# Altium schematic sheet USB_UART.SchDoc: USB UART
size Letter; Engineer: Nathan Petersen; DocumentNumber: 9; Revision: v1.2; SheetNumber: 9; SheetTotal: 26
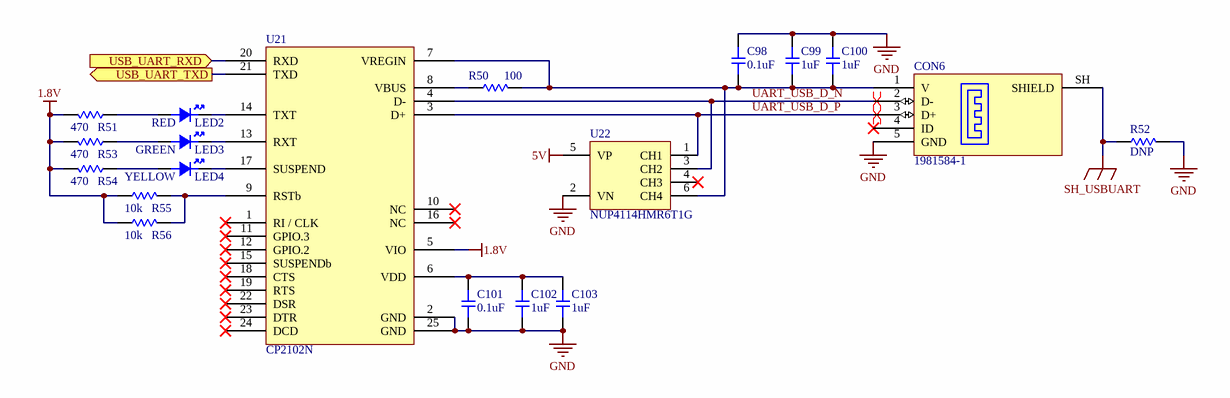
[diagram p0: USB_UART.SchDoc]

## Parts
C98  value 0.1uF  [0603-CAP]  (hidden comment: Capacitor)
C99  value 1uF  [0603-CAP]  (hidden comment: Capacitor)
C100  value 1uF  [0603-CAP]  (hidden comment: Capacitor)
C101  value 0.1uF  [0603-CAP]  (hidden comment: Capacitor)
C102  value 1uF  [0603-CAP]  (hidden comment: Capacitor)
C103  value 1uF  [0603-CAP]  (hidden comment: Capacitor)
CON6  1981584-1  [1981584-1]
LED2  value RED  [0603-LED]  (hidden comment: LED)
LED3  value GREEN  [0603-LED]  (hidden comment: LED)
LED4  value YELLOW  [0603-LED]  (hidden comment: LED)
R50  value 100  [0603-RES]  (hidden comment: Resistor)
R51  value 470  [0603-RES]  (hidden comment: Resistor)
R52  value DNP  [0603-RES]  (hidden comment: Resistor)
R53  value 470  [0603-RES]  (hidden comment: Resistor)
R54  value 470  [0603-RES]  (hidden comment: Resistor)
R55  value 10k  [0603-RES]  (hidden comment: Resistor)
R56  value 10k  [0603-RES]  (hidden comment: Resistor)
U21  CP2102N  [QFN50P400X400X80_HS-25N]
U22  NUP4114HMR6T1G  [TSOP95P280X110-6N]

## Ports
USB_UART_RXD (in), USB_UART_TXD (out)

## Nets
1.8V: R51.2 R53.2 R54.2 R55.1 R56.1 U21.5(VIO)
5V: U22.5(VP)
GND: C98.2 C99.2 C100.2 C101.1 C102.1 C103.1 CON6.5(GND) R52.2 U21.2(GND) U21.25(GND) U22.2(VN)
SH_USBUART: CON6.SH(SHIELD) R52.1
UART_USB_D_N: CON6.2(D-) U21.4(D-) U22.3(CH2)
UART_USB_D_P: CON6.3(D+) U21.3(D+) U22.1(CH1)
USB_UART_RXD: U21.20(RXD) ; port USB_UART_RXD
USB_UART_TXD: U21.21(TXD) ; port USB_UART_TXD
NetC98_1: C98.1 C99.1 C100.1 CON6.1(V) R50.2 U21.7(VREGIN) U22.6(CH4)
NetC101_2: C101.2 C102.2 C103.2 U21.6(VDD)
NetLED2_A: LED2.A R51.1
NetLED2_C: LED2.C U21.14(TXT)
NetLED3_A: LED3.A R53.1
NetLED3_C: LED3.C U21.13(RXT)
NetLED4_A: LED4.A R54.1
NetLED4_C: LED4.C U21.17(SUSPEND)
NetR50_1: R50.1 U21.8(VBUS)
NetR55_2: R55.2 R56.2 U21.9(RSTb)

Not connected (* = marked no-connect by the designer): CON6 4(ID)*; U21 1(RI_/_CLK)* 10(NC)* 11(GPIO.3)* 12(GPIO.2)* 15(SUSPENDb)* 16(NC)* 18(CTS)* 19(RTS)* 22(DSR)* 23(DTR)* 24(DCD)*; U22 4(CH3)*

## Layout directives
differential pair: UART_USB_D_N, UART_USB_D_P

## Notes on the sheet
- Title:
- File:
- Sheet:
- of
- Revision:
- Time:
- Date:
- Engineer:

## Library data of the parts
CON6 = 1981584-1: CONN RCPT MICRO USB TYPE AB; Supplier 1: Digi-Key; Supplier Part Number 1: A97799TR-ND
U21 = CP2102N: IC USB TO UART BRIDGE QFN24; Supplier 1: Digi-Key; Supplier Part Number 1: 336-5888-1-ND
U22 = NUP4114HMR6T1G: TVS DIODE 5.5V 10V 6TSOP; Supplier 1: Digi-Key; Supplier Part Number 1: NUP4114HMR6T1GOSCT-ND
C98-C103 = Capacitor: Supplier 1: Digi-Key
  C98 C101: Supplier Part Number 1: 1276-1012-1-ND
  C99 C100 C102 C103: Supplier Part Number 1: 1276-6524-1-ND
LED2-LED4 = LED: Supplier 1: Digi-Key
  LED2: Supplier Part Number 1: 160-1447-1-ND
  LED3: Supplier Part Number 1: 160-1446-1-ND
  LED4: Supplier Part Number 1: 160-1448-1-ND
R50-R56 = Resistor: Supplier 1: Digi-Key
  R50: Supplier Part Number 1: YAG3561CT-ND
  R51 R53 R54: Supplier Part Number 1: 311-470LDCT-ND
  R52: Supplier Part Number 1: P0.0GCT-ND
  R55 R56: Supplier Part Number 1: P10.0KHCT-ND